# EAGLE design receiver (EAGLE 9.5.0)
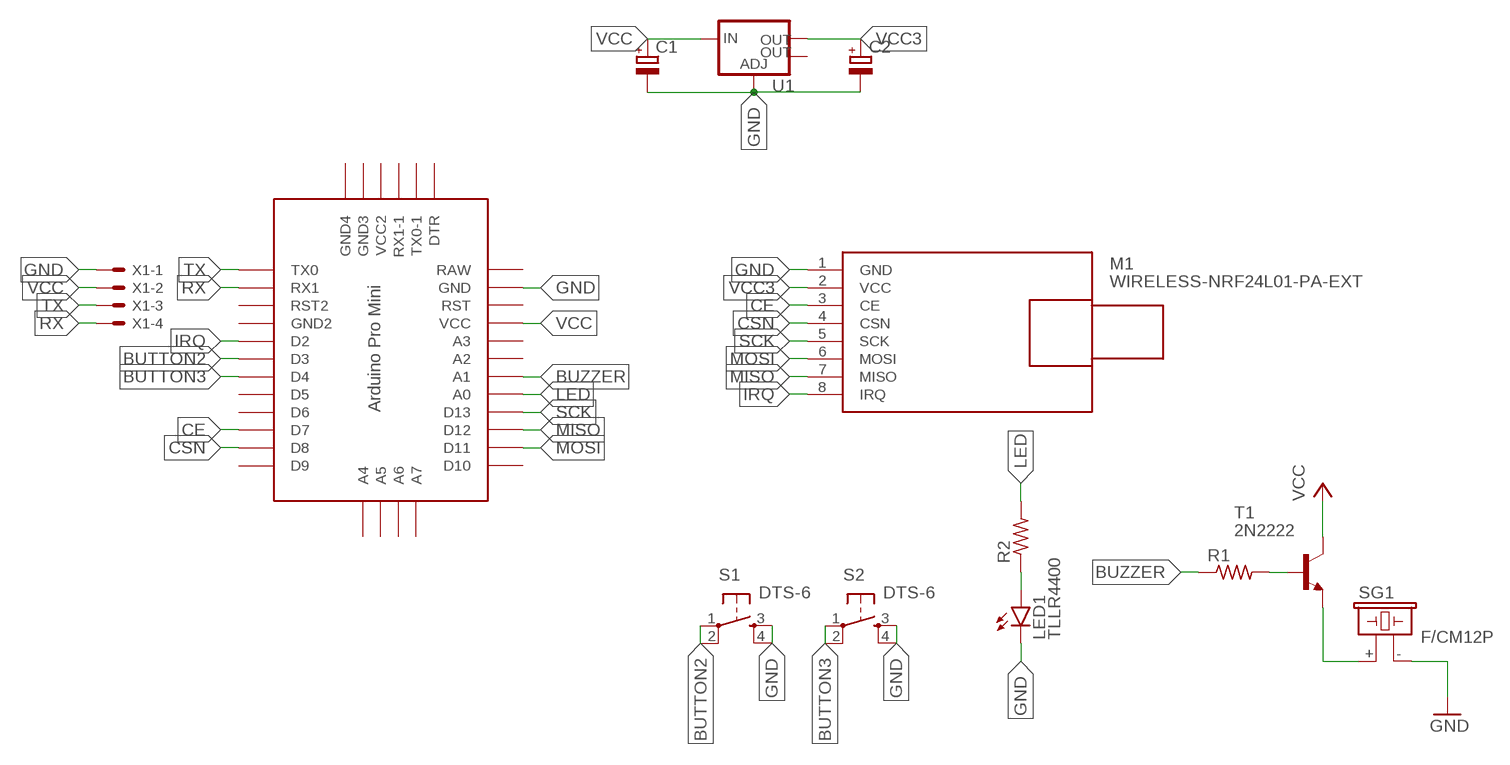
[diagram p0: schematic, sheet 1]

## Parts
C1  CPOL-EUE2,5-6E  [E2,5-6E]
C2  CPOL-EUE2,5-6E  [E2,5-6E]
LED1  TLLR4400  [LED3MM]
M1  WIRELESS-NRF24L01-PA-EXT  [WIRELESS-NRF24L01-PA-EXT]
R1  R-US_R0805  [R0805]
R2  R-US_R0805  [R0805]
S1  DTS-6  [DTS-6]
S2  DTS-6  [DTS-6]
SG1  F/CM12P  [F/CM12P]
T1  2N2222  [TO92-EBC-OVAL]
U1  V_REG_LM1117SOT223  [SOT223]
U$1  PRO-MINI  [PRO-MINI]
X1  KK-156-4  [KK-156-4]

## Nets
BUTTON2: S1.1 S1.2 U$1.D3
BUTTON3: S2.1 S2.2 U$1.D4
BUZZER: R1.1 U$1.A1
CE: M1.3(CE) U$1.D7
CSN: M1.4(CSN) U$1.D8
GND: C1.- C2.- LED1.K(C) M1.1(GND) S1.3 S1.4 S2.3 S2.4 SG1.- U1.1(ADJ) U$1.GND X1.1
IRQ: M1.8(IRQ) U$1.D2
LED: R2.2 U$1.A0
MISO: M1.7(MISO) U$1.D12
MOSI: M1.6(MOSI) U$1.D11
N$1: SG1.+ T1.E
N$2: R1.2 T1.B
N$3: LED1.A R2.1
RX: U$1.RX1 X1.4
SCK: M1.5(SCK) U$1.D13
TX: U$1.TX0 X1.3
VCC: C1.+ T1.C U1.3(IN) U$1.VCC X1.2
VCC3: C2.+ M1.2(VCC) U1.2(OUT)
Unconnected: U1.4(OUT) U$1.A2 U$1.A3 U$1.A4 U$1.A5 U$1.A6 U$1.A7 U$1.D5 U$1.D6 U$1.D9 U$1.D10 U$1.DTR U$1.GND1(GND2) U$1.GND2(GND4) U$1.GND3 U$1.RST U$1.RST1(RST2) U$1.RX1-1 U$1.TX0-1 U$1.VCC1(VCC2)

## Power pins joined to a net without a drawn wire
RAW: U$1.RAW

## Library data of the parts
C1 C2 = rcl:CPOL-EU: POLARIZED CAPACITOR, European symbol; SPICEPREFIX: C
LED1 = led:TLLR4400: Low Current (2mA) LED 3 mm Tinted Diffused Package color RED Source: Data sheet <http://www.farnell.com/datasheets/391100.pdf>; MF: VISHAY SEMICONDUCTOR; OC_FARNELL: 1612437
M1 = Diy Library:WIRELESS-NRF24L01-PA-EXT: 2.4 GHz Wireless Module based on NRF24L01 chip with preamplifier and external antenna Click here to find device on ebay.com <http://www.ebay.com/sch/nrf24l01+pa+lna+sma>
R1 R2 = adafruit:R-US_: RESISTOR, American symbol
S1 S2 = switch-tact:DTS-6
SG1 = buzzer:F/CM12P: BUZZER Source: Buerklin; OC_FARNELL: unknown; OC_NEWARK: unknown
T1 = adafruit:2N2222: NPN TRANSISTOR Big oval pads
U1 = SparkFun-IC-Power:V_REG_LM1117: Voltage Regulator LM1117 Standard adjustable voltage regulator but in SMD form. Spark Fun Electronics SKU : COM-00595; PROD_ID: VREG-08170
U$1 = Arduino-clone:PRO-MINI: Arduion Pro Mini Clone V1.0 www.betemcu.cu
X1 = con-molex:KK-156-4: KK 156 HEADER Source: http://www.molex.com/pdm_docs/sd/026604100_sd.pdf; MF: MOLEX; OC_FARNELL: unknown; OC_NEWARK: unknown

## Board
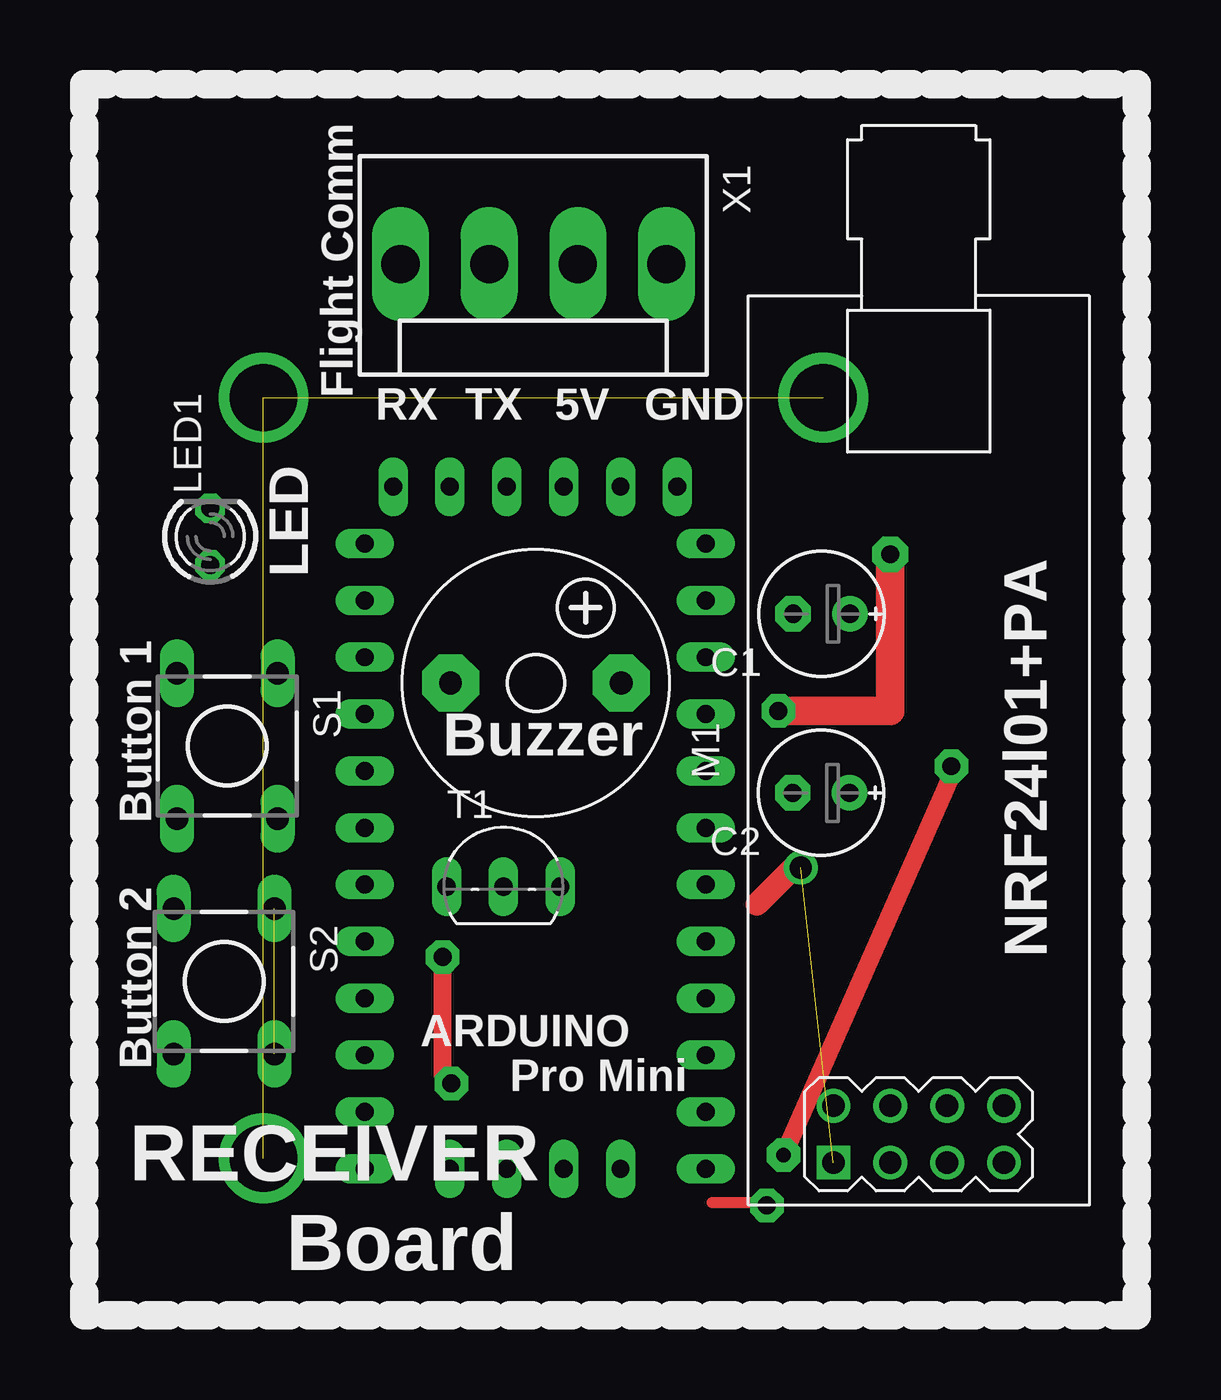
[diagram p1: board, top side]
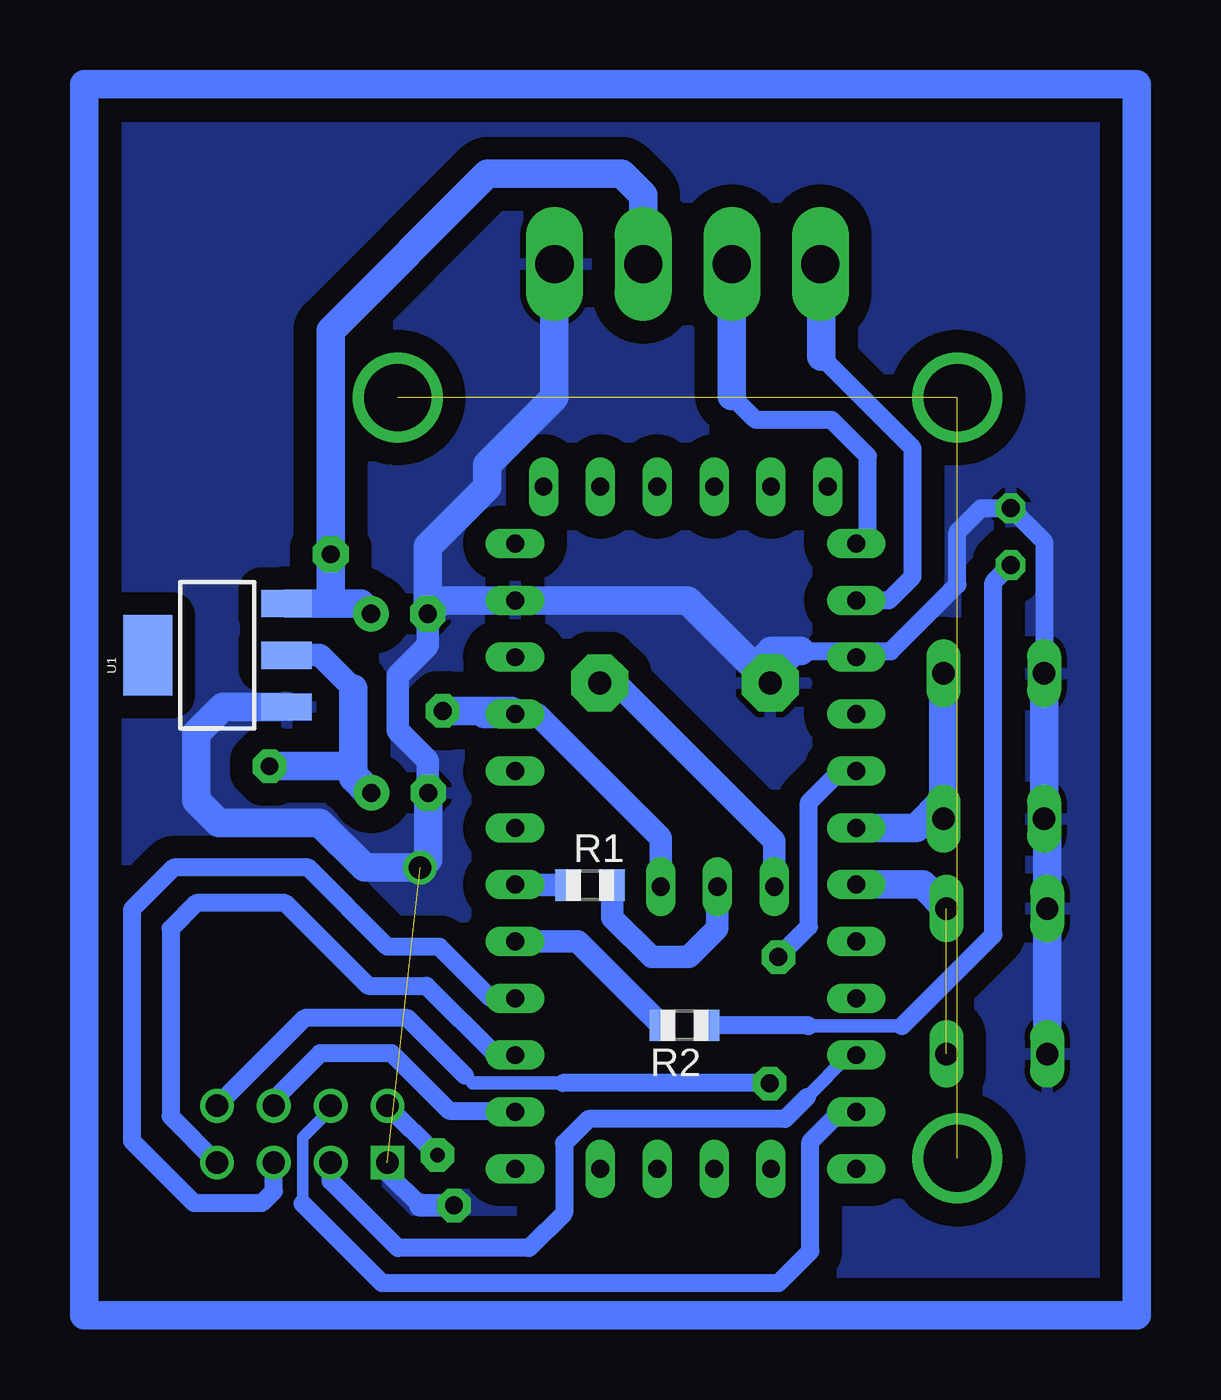
[diagram p2: board, bottom side, seen from below]

No outline drawn. Coordinates in mm, seen from the top.
Copper layers (1*16): Top 0.035mm / dielectric 1.5mm / Bottom 0.035mm
Design rules "default": minimum track width 6mil, minimum drill 0.35mm, track to track 6mil, track to pad 6mil, pad to pad 6mil, via to via 6mil, smd to smd 6mil, copper to edge 40mil, drill to drill 6mil, minimum pad ring 10mil, minimum via ring 8mil, stop-mask expansion 4mil, vias tented up to drill 0mil, thermal gap 10mil

### Footprints (pad centres in the part's own frame; a part is rotated, then mirrored left to right if it is on the bottom)
E2,5-6E = drill 0.813 pad 1.575: + -1.27,0 | drill 0.813 pad 1.575 octagon: - 1.27,0
LED3MM = drill 0.813 octagon: A -1.27,0; K 1.27,0
WIRELESS-NRF24L01-PA-EXT = drill 1 square: 1 -18.415,3.81 | drill 1: 2 -15.875,3.81; 3 -18.415,1.27; 4 -15.875,1.27; 5 -18.415,-1.27; 6 -15.875,-1.27; 7 -18.415,-3.81; 8 -15.875,-3.81
R0805 = smd 1.1 x 1.4: 1 -1,0; 2 1,0
DTS-6 = drill 1 long: 1 -3.25,2.25; 2 3.25,2.25; 3 -3.25,-2.25; 4 3.25,-2.25
F/CM12P = drill 1.016 pad 2.54 octagon: + 3.81,0; - -3.81,0
TO92-EBC-OVAL = drill 0.813 long: B 0,-1.27; C 2.54,-1.27; E -2.54,-1.27
SOT223 = smd 1.219 x 2.235: 1 -2.311,-3.099; 2 0,-3.099; 3 2.311,-3.099 | smd 3.6 x 2.2: 4 0,3.099
PRO-MINI = drill 0.8 long: A0 8.89,8.89; A1 8.89,11.43; A2 8.89,13.97; A3 8.89,16.51; A4 -2.54,-1.27; A5 0,-1.27; A6 2.54,-1.27; A7 5.08,-1.27; D2 -6.35,16.51; D3 -6.35,13.97; D4 -6.35,11.43; D5 -6.35,8.89; D6 -6.35,6.35; D7 -6.35,3.81; D8 -6.35,1.27; D9 -6.35,-1.27; D10 8.89,-1.27; D11 8.89,1.27; D12 8.89,3.81; D13 8.89,6.35; DTR 7.62,29.21; GND 8.89,24.13; GND1 -6.35,19.05; GND2 -5.08,29.21; GND3 -2.54,29.21; RAW 8.89,26.67; RST 8.89,21.59; RST1 -6.35,21.59; RX1 -6.35,24.13; RX1-1 2.54,29.21; TX0 -6.35,26.67; TX0-1 5.08,29.21; VCC 8.89,19.05; VCC1 0,29.21
KK-156-4 = drill 1.7 pad 2.184 long: 1 -5.94,0; 2 -1.98,0; 3 1.98,0; 4 5.94,0

### Placement (x,y rotation side)
C1  38.93,36.34 180 top
C2  38.91,28.34 180 top
LED1  11.62,39.79 90 top
M1  43.27,30.23 90 top
R1  30.41,24.22 0 bottom
R2  26.2,17.95 180 bottom
S1  12.38,30.43 270 top
S2  12.24,19.92 270 top
SG1  26.17,33.25 0 top
T1  24.72,25.42 0 top
U1  47.07,34.49 90 bottom
U$1  24.87,12.81 0 top
X1  26.06,51.97 180 top

### Tracks (layer width: path | path; a pad name or v marks a point on that pad's centre or on a via)
BUTTON2
  Bottom 1.27: S1.1 14.63,28 | 14.63,28 S1.2 | U$1.D3 15.85,26.78 14.63,28
BUTTON3  (1 unrouted)
  Bottom 1.27: S2.1 15.56,24.24 U$1.D4
BUZZER
  Bottom 1.016: U$1.A1 33.74,24.22 R1.1
CE
  Bottom 0.508: U$1.D7 19.03,16.62
  Bottom 0.61: 20.73,14.74 18.85,16.62 U$1.D7
  Bottom 0.813: 20.73,14.74 21.7,13.77 30.48,13.77 31.57,12.68 31.57,9.56 33.13,8 39,8 42,11 M1.3
CSN
  Bottom 0.508: U$1.D8 18.44,14 | M1.4 42,14.19 43.25,12.94 43.25,9.98
  Bottom 0.813: 43.25,9.98 39.7,6.43 22,6.43 20.57,7.86 20.57,12.75 19.24,14.08 U$1.D8
GND  (via drill 0.8 pad 1.5, 1)  (1 unrouted)
  Top 0.5: 34.04,10.04 36.35,10.04 v36.49,9.9
  Top 1.016: v38,25 37.69,25 36.04,23.35
  Bottom 0.813: 24.78,35.67 24.81,35.7 | SG1.- 22.36,33.31 21,34.67 16.97,34.67 14,37.64 14,40 12.94,41.06 LED1.K 10.13,39.57 S1.3 | M1.1 39.46,11.36 38,9.9
  Bottom 1.016: C1.- 37.66,34.98 | 37.66,34.98 37.72,34.92 | 37.66,34.98 37.66,34.93 39,33.59 39,31.13 37.66,29.79 37.66,28.36 | 38,9.9 v36.49,9.9
  Bottom 1.27: S2.4 S2.3 9.99,27.04 S1.4 S1.3 | 37.66,28.36 C2.- 37.64,25.36 v38,25 40.48,25 42.48,27 47,27 48,28 48,31 46.82,32.18 U1.1 | 32.03,52 X1.1 32,46 35,43 35,42 37.66,39.34 C1.- 37.06,36.94 U$1.GND | SG1.- 23.05,33.95 | 23.05,33.95 24.81,35.7 26.05,36.94 U$1.GND | 34.94,36.94 U$1.GND | 35.06,36.94 U$1.GND | 21,34.67 22.33,34.67 23.05,33.95
  pour Bottom (isolate 1.016): 7.72,5.49 52.08,5.49 52.08,58.31 7.72,58.31
IRQ  (via drill 0.8 pad 1.5)
  Top 0.813: v22.39,15.35 22,15.74 v22,21
  Bottom 0.508: 35.66,15.37 36,15.71
  Bottom 0.6: 31.62,15.37 35.66,15.37
  Bottom 0.813: 31.62,15.37 22.41,15.37 v22.39,15.35 | v22,21 20.64,22.36 20.64,27.92 19.24,29.32 U$1.D2 | M1.8 43.16,18.28 38.57,18.28 36,15.71
LED
  Bottom 1.016: R2.2 30.95,21.7 U$1.A0
MISO
  Bottom 0.813: U$1.D12 34.62,16.62 37.72,19.72 40.33,19.72 44.03,23.42 48,23.42 49.15,22.27 49.15,13.88 M1.7
MOSI
  Bottom 0.813: U$1.D11 33.82,14.14 36.71,14.14 39.27,16.7 42.47,16.7 44.54,14.62 M1.6
N$1
  Bottom 1.016: T1.E 22.18,26.18 29.25,33.25 SG1.+
N$2
  Bottom 1.016: R1.2 29.41,22.76 27.65,21 26,21 24.72,22.28 T1.B
N$3
  Bottom 0.508: 22.05,17.95 25,17.95 R2.1
  Bottom 0.61: 20.65,17.92 16.47,17.92
  Bottom 0.813: 20.65,17.92 20.68,17.95 25,17.95 | LED1.A 12.39,37.75 12.39,22 16.47,17.92
N$4  (via drill 3)  (2 unrouted)
  other vias: 14,46 39,46 14,12
N$5
  Bottom 1.27: 6,60 6,5 53,5 53,60 6,60
RX
  Bottom 0.813: U$1.RX1 17.06,36.94 16,38 16,43.74 20.09,47.83 | 20.09,52 X1.4
  Bottom 1.27: 20.09,47.83 20.09,52
SCK
  Bottom 0.813: U$1.D13 34.84,19.16 37.14,21.46 39.46,21.46 43,25 49,25 50.88,23.12 50.88,12.78 48.1,10 45.08,10 44.54,10.54 M1.5
TX
  Bottom 0.813: U$1.TX0 18,40 18,43.38 19.62,45 23,45 24.08,46.08 | 24.08,50.08 X1.3
  Bottom 1.27: 24.08,46.08 X1.3
VCC  (via drill 0.8 pad 1.5, 0.8 pad 1.6)
  Top 1.27: v42,39 42,32 v37,32
  Bottom 0.508: 33.9,32 34.57,32
  Bottom 1.016: U$1.VCC 32.8,31.86 27.26,26.32 T1.C
  Bottom 1.27: 35.14,31.86 U$1.VCC 33.9,32 v37,32 | C1.+ 40.66,36.8 42,36.8 | 42,36.8 U1.3 | 42,36.8 v42,39 42,49 35,56 29,56 28.04,55.04 X1.2
VCC3  (via drill 0.65 pad 1.5, 0.8 pad 1.5)
  Top 0.813: v44.73,29.53 44.73,29.1 v37.23,12.16
  Bottom 0.813: M1.2 37.27,12.16 v37.23,12.16
  Bottom 1.016: 41,33 42.49,34.49 U1.2
  Bottom 1.27: 41,33 41,29 40.34,28.34 C2.+ 41.37,29.53 v44.73,29.53

### Text on the board
tSilk: Flight Comm | RX | TX | 5V | GND | LED | Buzzer | Button 1 | NRF24l01+PA | ARDUINO | Button 2 | Pro Mini | RECEIVER | Board